# Altium project STM32c8t6_Core.PrjPCB
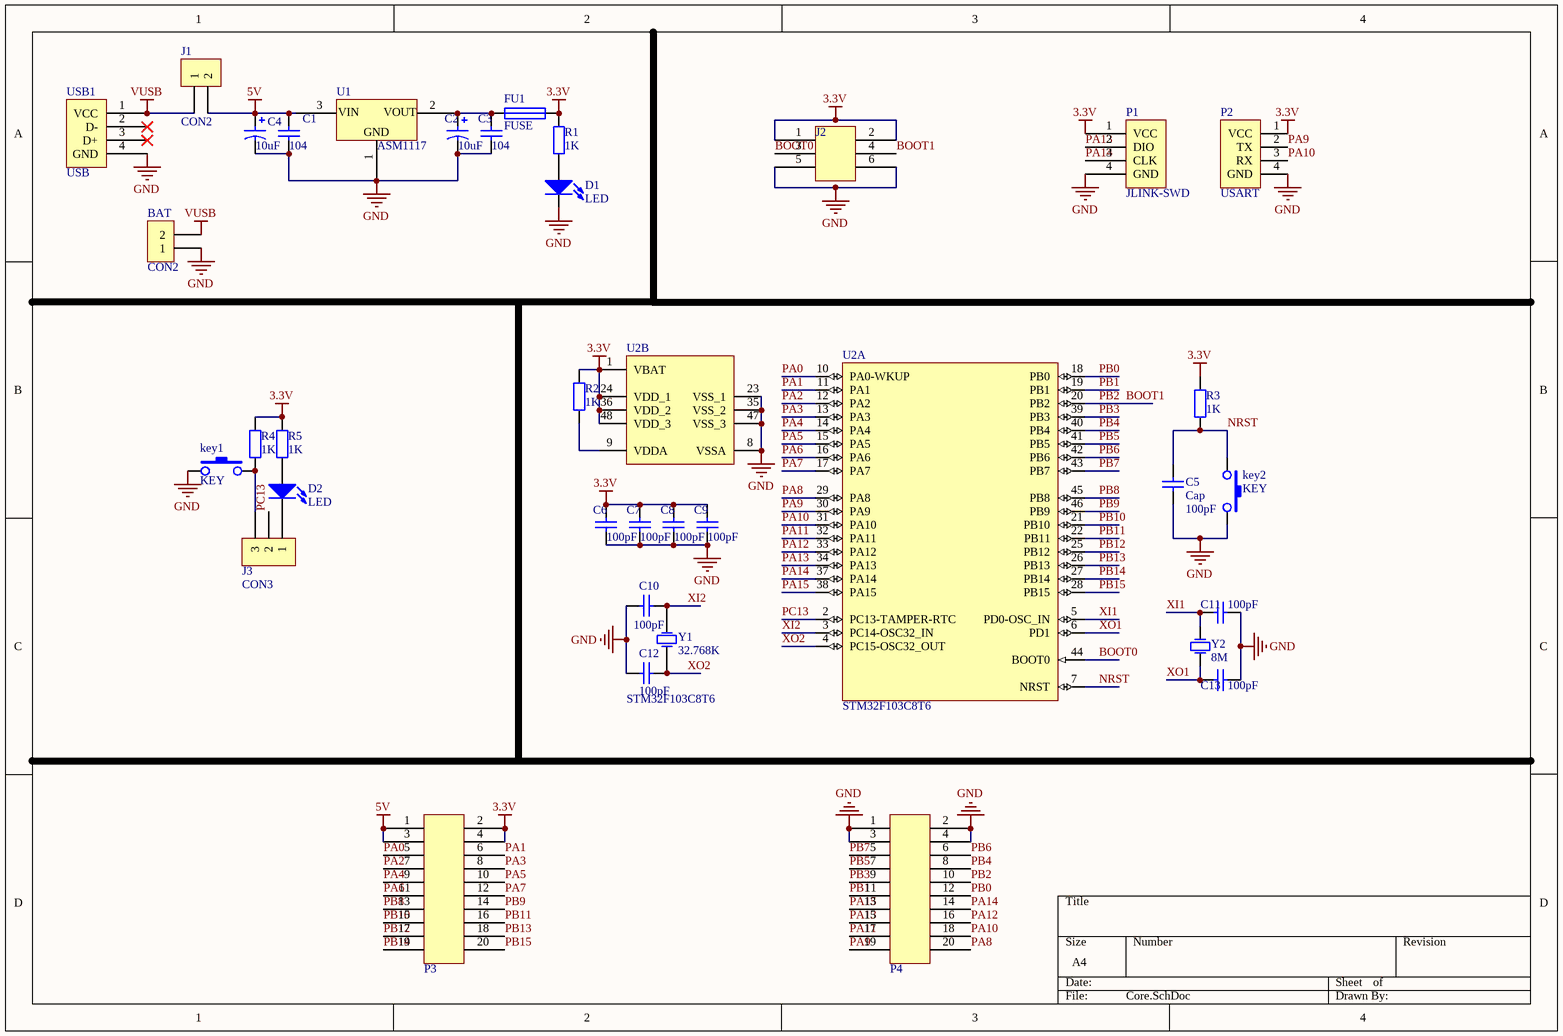
[diagram p0: Core.SchDoc]
1 sheet, 36 parts. Net scope: global (net labels, ports and power ports of the same name join across sheets).
Board file: Core.PcbDoc

## Sheet Core.SchDoc
size A4

### Parts
BAT  CON2  [SIP2]
C1  value 104  [0805C]  (hidden comment: Cap)
C2  value 10uF  [0805C]  (hidden comment: CapPol)
C3  value 104  [0805C]  (hidden comment: Cap)
C4  value 10uF  [0805C]  (hidden comment: CapPol)
C5  Cap  value 100pF  [0805C]
C6  value 100pF  [0805C]  (hidden comment: Cap)
C7  value 100pF  [0805C]  (hidden comment: Cap)
C8  value 100pF  [0805C]  (hidden comment: Cap)
C9  value 100pF  [0805C]  (hidden comment: Cap)
C10  value 100pF  [0805C]  (hidden comment: Cap)
C11  value 100pF  [0805C]  (hidden comment: Cap)
C12  value 100pF  [0805C]  (hidden comment: Cap)
C13  value 100pF  [0805C]  (hidden comment: Cap)
D1  LED  [0805D]
D2  LED  [0805D]
FU1  FUSE  [0805R]
J1  CON2  [SIP2]
J2  CON2X3  [SIP2x3]  (value not drawn)
J3  CON3  [SIP3]
key1  KEY  [KEY-3*6*2.5-SMD]
key2  KEY  [KEY-3*6*2.5-SMD]
P1  JLINK-SWD  [SIP4]
P2  USART  [SIP4]
P3  CON2X10  [SIP2x10]  (value not drawn)
P4  CON2X10  [SIP2x10]  (value not drawn)
R1  value 1K  [0805R]  (hidden comment: Res)
R2  value 1K  [0805R]  (hidden comment: Res)
R3  value 1K  [0805R]  (hidden comment: Res)
R4  value 1K  [0805R]  (hidden comment: Res)
R5  value 1K  [0805R]  (hidden comment: Res)
U1  ASM1117  [SOT223]
U2  STM32F103C8T6  [LQFP48_N]  (parts A,B of 2)
USB1  USB  [Micro_USB]
Y1  value 32.768K  [XTAL32]  (hidden comment: XTAL)
Y2  value 8M  [HC-49S]  (hidden comment: XTAL)

### Nets
3.3V: C6.1 C7.1 C8.1 C9.1 FU1.2 J2.1 J2.2 P1.1(VCC) P2.1(VCC) P3.2 P3.4 R1.1 R2.2 R3.2 R4.1 R5.1 U2.1(VBAT) U2.24(VDD_1) U2.36(VDD_2) U2.48(VDD_3)
5V: C1.1 C4.1 J1.2 P3.1 P3.3 U1.3(VIN)
GND: BAT.1 C1.2 C2.2 C3.2 C4.2 C5.1 C6.2 C7.2 C8.2 C9.2 C10.1 C11.1 C12.1 C13.1 D1.2(K) J2.5 J2.6 key1.1 key2.2 P1.4(GND) P2.4(GND) P4.1 P4.2 P4.3 P4.4 U1.1(GND) U2.8(VSSA) U2.23(VSS_1) U2.35(VSS_2) U2.47(VSS_3) USB1.4(GND)
VUSB: BAT.2 J1.1 USB1.1(VCC)
BOOT0: J2.3 U2.44(BOOT0)
BOOT1: J2.4 P4.10 U2.20(PB2)  [also labelled PB2]
NRST: C5.2 key2.1 R3.1 U2.7(NRST)
PA0: P3.5 U2.10(PA0-WKUP)
PA1: P3.6 U2.11(PA1)
PA2: P3.7 U2.12(PA2)
PA3: P3.8 U2.13(PA3)
PA4: P3.9 U2.14(PA4)
PA5: P3.10 U2.15(PA5)
PA6: P3.11 U2.16(PA6)
PA7: P3.12 U2.17(PA7)
PA8: P4.20 U2.29(PA8)
PA9: P2.2(TX) P4.19 U2.30(PA9)
PA10: P2.3(RX) P4.18 U2.31(PA10)
PA11: P4.17 U2.32(PA11)
PA12: P4.16 U2.33(PA12)
PA13: P1.2(DIO) P4.15 U2.34(PA13)
PA14: P1.3(CLK) P4.14 U2.37(PA14)
PA15: P4.13 U2.38(PA15)
PB0: P4.12 U2.18(PB0)
PB1: P4.11 U2.19(PB1)
PB3: P4.9 U2.39(PB3)
PB4: P4.8 U2.40(PB4)
PB5: P4.7 U2.41(PB5)
PB6: P4.6 U2.42(PB6)
PB7: P4.5 U2.43(PB7)
PB8: P3.13 U2.45(PB8)
PB9: P3.14 U2.46(PB9)
PB10: P3.15 U2.21(PB10)
PB11: P3.16 U2.22(PB11)
PB12: P3.17 U2.25(PB12)
PB13: P3.18 U2.26(PB13)
PB14: P3.19 U2.27(PB14)
PB15: P3.20 U2.28(PB15)
PC13: J3.2 U2.2(PC13-TAMPER-RTC)
XI1: C11.2 U2.5(PD0-OSC_IN) Y2.2(OSC2)
XI2: C10.2 U2.3(PC14-OSC32_IN) Y1.2(OSC2)
XO1: C13.2 U2.6(PD1) Y2.1(OSC1)
XO2: C12.2 U2.4(PC15-OSC32_OUT) Y1.1(OSC1)
NetC2_1: C2.1 C3.1 FU1.1 U1.2(VOUT)
NetD1_1: D1.1(A) R1.2
NetD2_1: D2.1(A) R5.2
NetD2_2: D2.2(K) J3.1
NetJ3_3: J3.3 key1.2 R4.2
NetR2_1: R2.1 U2.9(VDDA)

Not connected (* = marked no-connect by the designer): USB1 2(D-)* 3(D+)*

### Library data of the parts
C1 C3 C5-C13 = Cap: Capacitor; Published: 8-Jun-2000; LatestRevisionDate: 17-Jul-2002; LatestRevisionNote: Re-released for DXP Platform.; PackageReference: RAD-0.3; Publisher: Altium Limited
C2 C4 = CapPol: Polarized Capacitor (Axial); Published: 8-Jun-2000; LatestRevisionDate: 17-Jul-2002; LatestRevisionNote: Re-released for DXP Platform.; PackageReference: POLAR0.8; Publisher: Altium Limited
D1 D2 = LED: Typical INFRARED GaAs LED; Published: 8-Jun-2000; LatestRevisionDate: 08-Jul-2005; LatestRevisionNote: Mech Layer 1 removed.; PackageReference: LED-0; Publisher: Altium Limited
R1-R5 = Res: Resistor; Published: 8-Jun-2000; LatestRevisionDate: 17-Jul-2002; LatestRevisionNote: Re-released for DXP Platform.; PackageReference: AXIAL-0.4; Publisher: Altium Limited
U2 = STM32F103C8T6: STM32 ARM-based 32-bit MCU; DatasheetVersion: rev13.0, Apr-2011; PackageVersion: rev13, Apr-2011; PackageReference: LQFP48; PackageDescription: 48-Pin Low-Profile Quad Flat Pack, 7 x 7 mm Body, 0.5 mm Pitch (LQFP48); ComponentLink1Description: Manufacturer URL; ComponentLink1URL: http://www.st.com/; ComponentLink2Description: STM32F103 Datasheet; ComponentLink2URL: http://www.st.com/internet/com/TECHNICAL_RESOURCES/TECHNICAL_LITERATURE/DATASHEET/CD00161566.pdf; ComponentLink3Description: STM32 Family Web Page; ComponentLink3URL: www.st.com/stm32
Y1 = XTAL: Crystal Oscillator
Y2 = XTAL: 晶振